# Altium project PCB_Project.PrjPcb
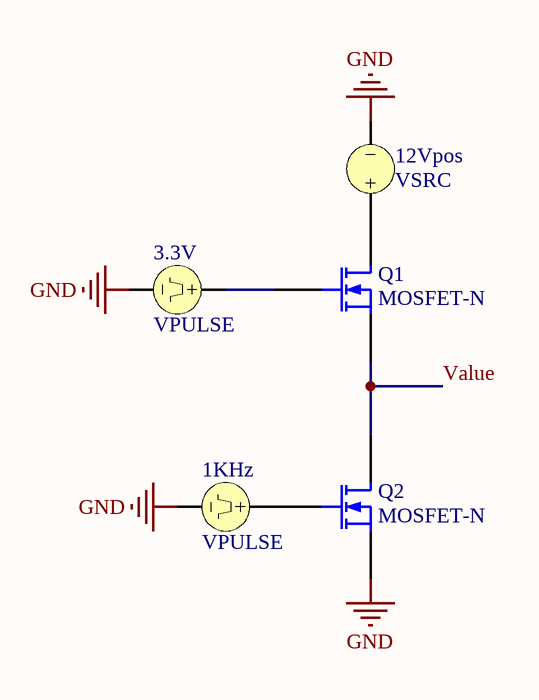
[diagram p0: Sheet1.SchDoc]
1 sheet, 5 parts. Net scope: global (net labels, ports and power ports of the same name join across sheets).

## Sheet Sheet1.SchDoc
size A4

### Parts
1KHz  VPULSE
3.3V  VPULSE
12Vpos  VSRC
Q1  MOSFET-N  [E3]
Q2  MOSFET-N  [E3]

### Nets
GND: 1KHz.2 3.3V.2 12Vpos.2 Q2.3(S)
Value: Q1.3(S) Q2.1(D)
Net1KHz_1: 1KHz.1 Q2.2(G)
Net3.3V_1: 3.3V.1 Q1.2(G)
Net12Vpos_1: 12Vpos.1 Q1.1(D)

### Library data of the parts
1KHz 3.3V = VPULSE: Pulse Voltage Source; Note: PCB Footprint - Not required; Published: 8-Jun-2000; LatestRevisionDate: 15-Nov-2004; LatestRevisionNote: Corrected Netlist.; PackageReference: Not Applicable; Publisher: Altium Limited
12Vpos = VSRC: Voltage Source; Note: PCB Footprint - Not required; Value: +24; Published: 8-Jun-2000; LatestRevisionDate: 17-Jul-2002; LatestRevisionNote: Re-released for DXP Platform.; PackageReference: Not Applicable; Publisher: Altium Limited
Q1 Q2 = MOSFET-N: N-Channel MOSFET; Published: 8-Jun-2000; LatestRevisionDate: 17-Jul-2002; LatestRevisionNote: Re-released for DXP Platform.; PackageVersion: 1995/1996; PackageReference: E3; Publisher: Altium Limited; PackageDescription: TO, Flat Index; 3 In-Line, Axial Leads; Body Dia. 4.6mm; Lead Dia. 0.5 mm (max)